# EAGLE schematic MediumCollar1.1 v26 (EAGLE 9.7.0)
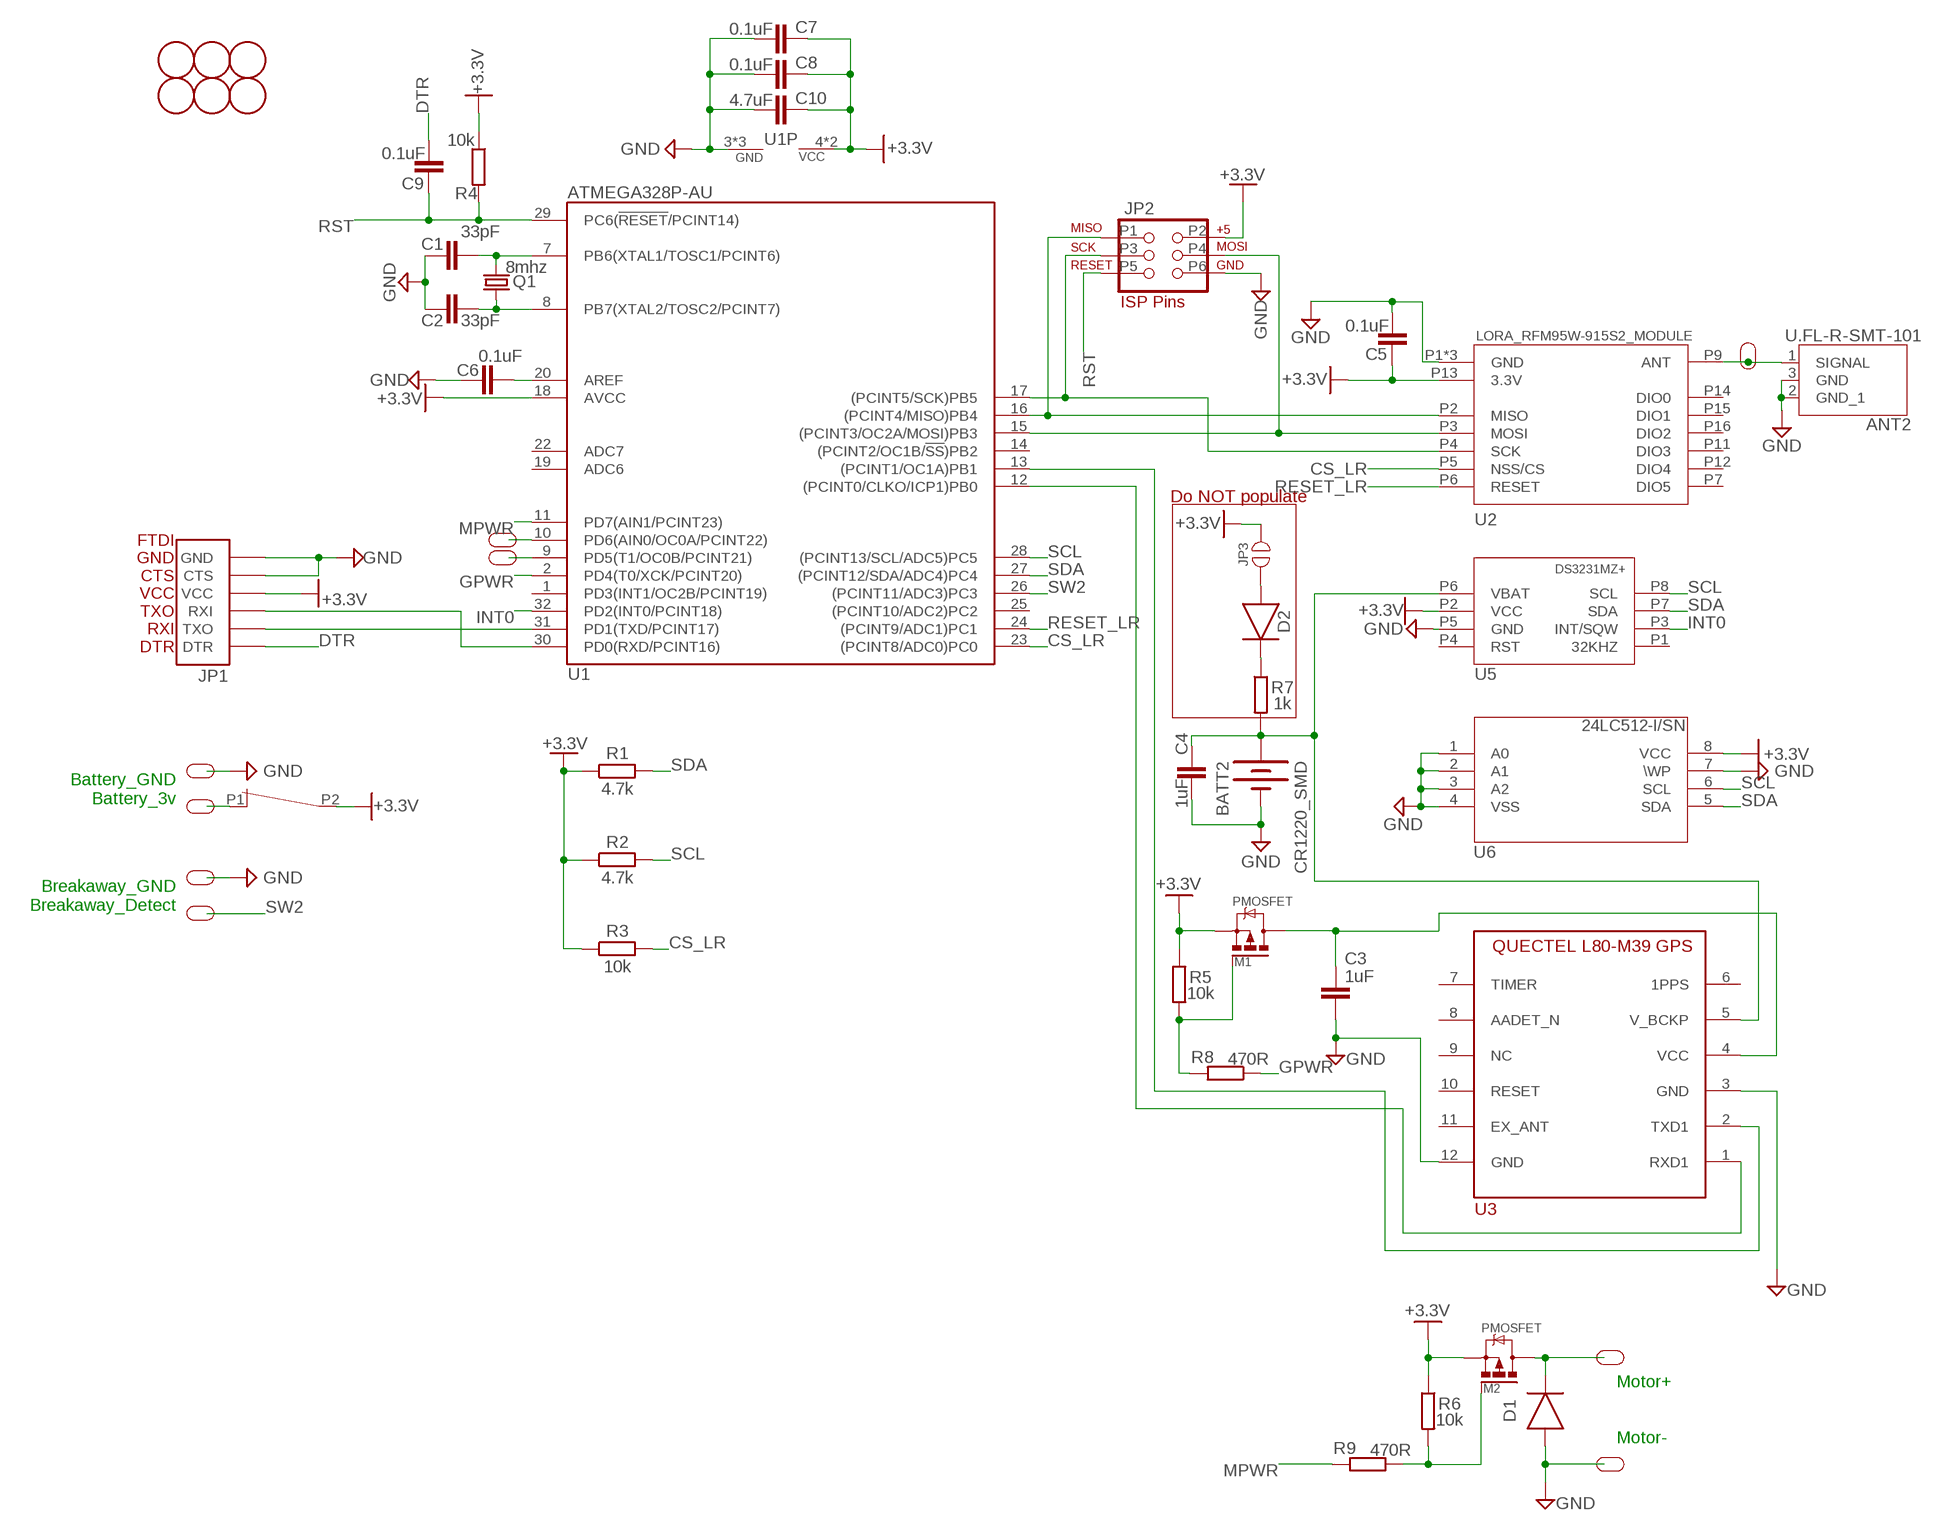
[diagram p0: schematic, sheet 1]

## Parts
ANT1  BREAKOUT_PADBREAKOUT_THT  [BREAKOUT_THT*1*1MM]
ANT2  U.FL-R-SMT-101  [U.FL-R-SMT-1(XX)]
BATT2  CR1220_SMD  [CR1220_2P_SMD]
BATT+  BREAKOUT_PADBREAKOUT_THT  [BREAKOUT_THT*1*1MM]
BGND  BREAKOUT_PADBREAKOUT_THT  [BREAKOUT_THT*1*1MM]
C1  33pF  C_CHIP-0805(2012-METRIC)  [CAPC2012X110]
C2  33pF  C_CHIP-0805(2012-METRIC)  [CAPC2012X110]
C3  1uF  C_CHIP-0805(2012-METRIC)  [CAPC2012X110]
C4  1uF  C_CHIP-0805(2012-METRIC)  [CAPC2012X110]
C5  0.1uF  C_CHIP-0805(2012-METRIC)  [CAPC2012X110]
C6  0.1uF  C_CHIP-0805(2012-METRIC)  [CAPC2012X110]
C7  0.1uF  C_CHIP-0805(2012-METRIC)  [CAPC2012X110]
C8  0.1uF  C_CHIP-0805(2012-METRIC)  [CAPC2012X110]
C9  0.1uF  C_CHIP-0805(2012-METRIC)  [CAPC2012X110]
C10  4.7uF  C_CHIP-0805(2012-METRIC)  [CAPC2012X110]
D1  DIODE  DIODEDO-214AC(SMA)  [DIOM5226X290N]
D2  DIODE  DIODEDO-214AC(SMA)  [DIOM5226X290N]
F1  FIDUCIAL  [FIDUCIAL_1MM]
F2  FIDUCIAL  [FIDUCIAL_1MM]
F3  FIDUCIAL  [FIDUCIAL_1MM]
F4  FIDUCIAL  [FIDUCIAL_1MM]
F5  FIDUCIAL  [FIDUCIAL_1MM]
F6  FIDUCIAL  [FIDUCIAL_1MM]
JP1  FTDI_DEVICEGTS_FLIP  [FTDI_DEVICE_SMD(GTS_FLIP)]
JP2  AVR_SPI_PRG_61X6_THT  [1X6-THT]
JP3  NO_JUMPER  [NO_JUMPER]
M1  PMOSFET  PMOSFET_SOT23  [SOT23]
M2  PMOSFET  PMOSFET_SOT23  [SOT23]
M+  BREAKOUT_PADBREAKOUT_THT  [BREAKOUT_THT*1*1MM]
M-  BREAKOUT_PADBREAKOUT_THT  [BREAKOUT_THT*1*1MM]
PD5  BREAKOUT_PADL  [BREAKOUT_PAD*1*1X2MM]
PD6  BREAKOUT_PADL  [BREAKOUT_PAD*1*1X2MM]
Q1  8mhz  CRYSTALHC49UP  [HC49UP]
R1  4.7k  R_CHIP-0805(2012-METRIC)  [RESC2012X65]
R2  4.7k  R_CHIP-0805(2012-METRIC)  [RESC2012X65]
R3  10k  R_CHIP-0805(2012-METRIC)  [RESC2012X65]
R4  10k  R_CHIP-0805(2012-METRIC)  [RESC2012X65]
R5  10k  R_CHIP-0805(2012-METRIC)  [RESC2012X65]
R6  10k  R_CHIP-0805(2012-METRIC)  [RESC2012X65]
R7  1k  R_CHIP-0805(2012-METRIC)  [RESC2012X65]
R8  470R  R_CHIP-0805(2012-METRIC)  [RESC2012X65]
R9  470R  R_CHIP-0805(2012-METRIC)  [RESC2012X65]
SW1  REED_SWITCH  [REED_CT05]
SW2_GND  BREAKOUT_PADBREAKOUT_THT  [BREAKOUT_THT*1*1MM]
SW2_PIN  BREAKOUT_PADBREAKOUT_THT  [BREAKOUT_THT*1*1MM]
U1  ATMEGA328P-AU  [QFP32_7X7_0.80]
U2  LORA_RFM95W-915S2_MODULE  [LORA_RFM95W-915S2_16MODULE]
U3  L80_GNSS_MODULE  [L80_PACKAGE]
U5  DS3231MZ+  [DS3231MZ+_SOIC8]
U6  24LC128T-I/SN  [SOIC8-N_MC_MCH]

## Nets
3.3V_GPS [Power]: C3.1 M1.3(D) U3.4(VCC)
+3.3V [Power]: C5.1 C7.1 C8.1 C10.1 JP1.P4(VCC) JP2.P2 JP3.P$2 M1.2(S) M2.2(S) R1.1 R2.1 R3.1 R4.1 R5.1 R6.1 SW1.P2(PAD2) U1.4(VCC) U1.6(VCC) U1.18(AVCC) U2.P13(3.3V) U5.P2(VCC) U6.8(VCC)
+BATT [Power]: BATT+.P$1 SW1.P1(PAD1)
AREF: C6.2 U1.20(AREF)
BREAK_MOTOR+ [Power]: D1.1(C) M2.3(D) M+.P$1
CS_LR: R3.2 U1.23((PCINT8/ADC0)PC0) U2.P5(NSS/CS)
DTR: C9.2 JP1.P1(DTR)
GND [Power]: ANT2.2(GND_1) ANT2.3(GND) BATT2.P-(-) BGND.P$1 C1.1 C2.1 C3.2 C4.2 C5.2 C6.1 C7.2 C8.2 C10.2 D1.2(A) JP1.P5(CTS) JP1.P6(GND) JP2.P6 M-.P$1 SW2_GND.P$1 U1.3(GND) U1.5(GND) U1.21(GND) U2.P1(GND) U2.P8(GND) U2.P10(GND) U3.3(GND) U3.12(GND) U5.P5(GND) U6.1(A0) U6.2(A1) U6.3(A2) U6.4(VSS) U6.7(\WP)
GPS_POWER: M1.1(G) R5.2 R8.2
GPWR: R8.1 U1.2(PD4(T0/XCK/PCINT20))
INT0: U1.32(PD2(INT0/PCINT18)) U5.P3(INT/SQW)
LR_ANT [RF]: ANT1.P$1 ANT2.1(SIGNAL) U2.P9(ANT)
MISO: JP2.P1 U1.16((PCINT4/MISO)PB4) U2.P2(MISO)
MOSI: JP2.P4 U1.15((PCINT3/OC2A/MOSI)PB3) U2.P3(MOSI)
MOTOR_PWR: M2.1(G) R6.2 R9.1
MPWR: R9.2 U1.11(PD7(AIN1/PCINT23))
PD5: PD5.P$1 U1.9(PD5(T1/OC0B/PCINT21))
PD6: PD6.P$1 U1.10(PD6(AIN0/OC0A/PCINT22))
Q1: C2.2 Q1.1 U1.8(PB7(XTAL2/TOSC2/PCINT7))
Q2: C1.2 Q1.2 U1.7(PB6(XTAL1/TOSC1/PCINT6))
RESET_LR: U1.24((PCINT9/ADC1)PC1) U2.P6(RESET)
RST: C9.1 JP2.P5 R4.2 U1.29(PC6(!RESET!/PCINT14))
RTC_BATT [Power]: BATT2.P+(+) C4.1 R7.2 U3.5(V_BCKP) U5.P6(VBAT)
RTC_RCHG: D2.1(C) R7.1
RTC_RCHG2: D2.2(A) JP3.P$1
RX_GPS: U1.12((PCINT0/CLKO/ICP1)PB0) U3.1(RXD1)
RXD: JP1.P3(RXI) U1.30(PD0(RXD/PCINT16))
SCK: JP2.P3 U1.17((PCINT5/SCK)PB5) U2.P4(SCK)
SCL: R2.2 U1.28((PCINT13/SCL/ADC5)PC5) U5.P8(SCL) U6.6(SCL)
SDA: R1.2 U1.27((PCINT12/SDA/ADC4)PC4) U5.P7(SDA) U6.5(SDA)
SW2: SW2_PIN.P$1 U1.26((PCINT11/ADC3)PC3)
TX_GPS: U1.13((PCINT1/OC1A)PB1) U3.2(TXD1)
TXD: JP1.P2(TXO) U1.31(PD1(TXD/PCINT17))
Unconnected: U1.1(PD3(INT1/OC2B/PCINT19)) U1.14((PCINT2/OC1B/!SS!)PB2) U1.19(ADC6) U1.22(ADC7) U1.25((PCINT10/ADC2)PC2) U2.P7(DIO5) U2.P11(DIO3) U2.P12(DIO4) U2.P14(DIO0) U2.P15(DIO1) U2.P16(DIO2) U3.6(1PPS) U3.7(TIMER) U3.8(AADET_N) U3.9(NC) U3.10(RESET) U3.11(EX_ANT) U5.P1(32KHZ) U5.P4(RST)

## Notes on the sheet
- ISP Pins
- Do NOT populate
- FTDI
  GND
  CTS
  VCC
  TXO
  RXI
  DTR
- Battery_GND
  Battery_3v
- Breakaway_GND
  Breakaway_Detect
- Motor+
  
  
  Motor-

## Library data of the parts
ANT1 BATT+ BGND M+ M- PD5 PD6 SW2_GND SW2_PIN = CDC Library:BREAKOUT_PAD
ANT2 = Connector:U.FL-R-SMT-1: U.FL (UMCC) Connector Receptacle, Male Pin 50Ohm Surface Mount Solder Datasheet <https://media.digikey.com/pdf/Data%20Sheets/Hirose%20PDFs/UFL%20Series.pdf> Drawing <https://www.hirose.com/product/document?clcode=CL0331-0472-2-10&productname=U.FL-R-SMT-1(10)&series=U.FL&documenttype=2DDrawing&lang=en&documentid=0000940684>; CATEGORY: Connector; DESCRIPTION: Ultra Small Surface Mount Coaxial Connectors; LINK: https://www.sunrom.com/p/rf-antenna-connector-smd-ipx-ipex-ulf-mhf; MANUFACTURER: Hirose Electric Co Ltd; MPN: U.FL-R-SMT-1(01); OPERATING_TEMPERATURE: -40˚C to +90˚C; PART_STATUS: Active; ROHS_COMPLIANCE: RoHS Compliant; SERIES: U.FL; TYPE: RF Connector
BATT2 = CDC Library:CR1220_SMD; LINK: https://www.sunrom.com/p/battery-socket-for-cr1220
C1 C2 = Capacitor:C: Capacitor - Generic; CATEGORY: Capacitor; LINK: https://www.evelta.com/33-pf-50v-0805-smd-multilayer-ceramic-capacitors-0805cg330j500nt-fenghua/
C3 C4 = Capacitor:C: Capacitor - Generic; CATEGORY: Capacitor; LINK: https://www.sunrom.com/p/1uf-105-smd-0805-pack-of-10
C5-C9 = Capacitor:C: Capacitor - Generic; CATEGORY: Capacitor; LINK: https://www.sunrom.com/p/100nf-104-0805-2012-metric
C10 = Capacitor:C: Capacitor - Generic; CATEGORY: Capacitor; LINK: https://www.evelta.com/4-7-uf-16v-0805-smd-multi-layer-ceramic-capacitor-0805x475k160ct-walsin/
D1 D2 = Diode:DIODE: Diode Rectifier - Generic; CATEGORY: Diode; LINK: https://www.sunrom.com/p/m7-1n4007-smd-1a-diode; SUB-CATEGORY: Rectifier
F1-F6 = CDC Library:FIDUCIAL: For use by pick and place machines to calibrate the vision/machine, 1mm By microbuilder.eu
JP1 = CDC Library:FTDI_DEVICE: Connector which mates to FTDI basic or FTDI cable.
JP2 = CDC Library:AVR_SPI_PRG_6: AVR ISP 6 Pin This is the reduced ISP connector for AVR programming. Common on Arduino. This footprint will take up less PCB space and can be used with a 10-pin to 6-pin adapter such as SKU: BOB-08508 **Special note about "TEST_POINT" package. The stop mask is on the top side, so if you want your programming test points to be on the bottom of your board, make sure to place this package on the bottom side of the board. This also ensure that the orientation to program from the bottom side will be correct.
JP3 = CDC Library:NO_JUMPER
M1 M2 = Transistor:PMOSFET: P-Channel MOSFET - Generic; CATEGORY: Transistor; LINK1: https://www.sunrom.com/p/ao3401-a19t-sot-23-p-ch-mosfet; SUB-CATEGORY: MOSFET; TYPE: P-Channel
Q1 = CDC Library:CRYSTAL: CRYSTAL; LINK: https://www.evelta.com/hc-49smd-8mhz-20pf-20ppm-2pad-smd-smt-quartz-crystal/; OC_FARNELL: unknown; OC_NEWARK: unknown
R1 R2 = Resistor:R: Resistor Fixed - Generic; CATEGORY: Resistor; LINK: https://www.sunrom.com/p/4k7-1-0805-pack-of-100; SUB-CATEGORY: Fixed
R3-R6 = Resistor:R: Resistor Fixed - Generic; CATEGORY: Resistor; LINK: https://www.sunrom.com/p/10k-1-0805-pack-of-100; SUB-CATEGORY: Fixed
R7 = Resistor:R: Resistor Fixed - Generic; CATEGORY: Resistor; LINK: https://www.sunrom.com/p/1k-1-0805-pack-of-100; SUB-CATEGORY: Fixed
R8 R9 = Resistor:R: Resistor Fixed - Generic; CATEGORY: Resistor; LINK: https://www.sunrom.com/p/470r-1-0805-pack-of-100; SUB-CATEGORY: Fixed
SW1 = CDC Library:REED_SWITCH
U1 = CDC Library:ATMEGA*8: 8-bit AVR Microcontroller 4/8/16/32 kbytes flash 512/1k/1k/2k bytes SRAM 256/512/512/1k bytes EEPROM USART, 6/8-channel 10 bit ADC Pin compatible with Atmega8(L,A) Note: ADC6 and ADC7 are not available in 28-lead packages; LINK: https://www.evelta.com/atmega328p-au-ic-mcu-8bit-32kb-flash-32tqfp/
U2 = CDC Library:LORA_RFM95W-915S2_MODULE; LINK: https://www.digikey.in/product-detail/en/rf-solutions/RFM95W-915S2/RFM95W-915S2-ND/6564923
U3 = CDC Library:L80_GNSS_MODULE: GPS module with an embedded patch antenna (15mmx15mmx4mm)
U5 = CDC Library:DS3231MZ+; LINK: https://www.evelta.com/ds3231mz-maxim-integrated-alarm-rtc-i2c-2-3-v-to-5-5-v/
U6 = AD_ECAD_Toolbag:24LC128T-I/SN; BUILT_BY: EMA_UL_Team; LINK: https://www.evelta.com/24lc512-i-sn-microchip-technology-eeprom-i2c-512-kbit/; MANUFACTURER_PART_NUMBER: 24LC128T-I/SN; SOURCELIBRARY: Microchip_2014-06-20; VAL: 24LC512-I/SN; VENDOR: Microchip

## Net classes
0 default: width 0.2 mm, drill 0.4 mm
1 Power: width 0.35 mm, drill 0.4 mm
2 RF: width 0.35 mm, drill 0.4 mm, clearance 0.203 mm